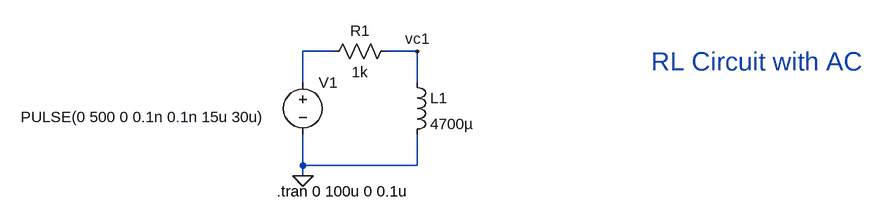
[diagram p0: schematic RL_via_AC.asc]
RL_via_AC.asc, the LTspice schematic file:
Version 4.1
SHEET 1 1192 680
WIRE -208 112 -256 112
WIRE -80 112 -128 112
WIRE -256 160 -256 112
WIRE -80 160 -80 112
WIRE -256 288 -256 240
WIRE -80 288 -80 240
WIRE -80 288 -256 288
WIRE -256 304 -256 288
FLAG -256 304 0
FLAG -80 112 vc1
SYMBOL voltage -256 144 R0
WINDOW 123 0 0 Left 0
WINDOW 39 0 0 Left 0
WINDOW 3 -434 69 Left 2
SYMATTR Value PULSE(0 500 0 0.1n 0.1n 15u 30u)
SYMATTR InstName V1
SYMBOL res -112 96 R90
WINDOW 0 0 56 VBottom 2
WINDOW 3 32 56 VTop 2
SYMATTR InstName R1
SYMATTR Value 1k
SYMBOL ind -96 144 R0
SYMATTR InstName L1
SYMATTR Value 4700µ
TEXT -296 328 Left 2 !.tran 0 100u 0 0.1u
TEXT 280 128 Left 4 ;RL Circuit with AC

The netlist it stands for:
* RL_via_AC.asc
V1 N001 0 PULSE(0 500 0 0.1n 0.1n 15u 30u)
R1 vc1 N001 1k
L1 vc1 0 4700µ
.tran 0 100u 0 0.1u
* RL Circuit with AC
.backanno
.end